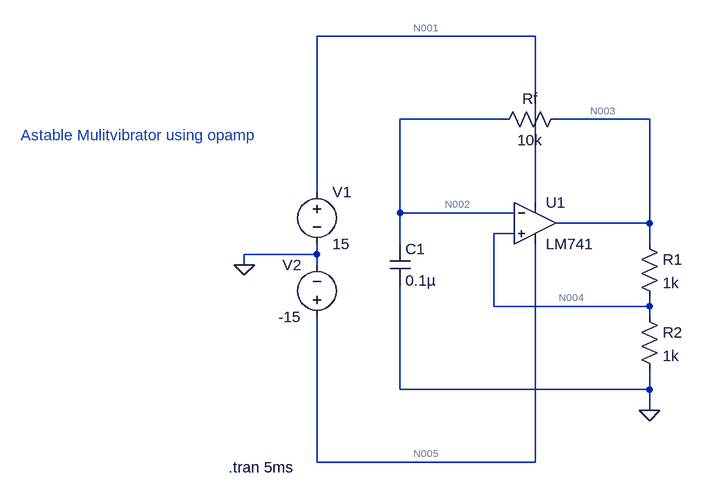
[diagram p0: schematic Astable_Multipvibrator.asc]
Astable_Multipvibrator.asc, the LTspice schematic file:
Version 4
SHEET 1 880 680
WIRE 448 -112 112 -112
WIRE 400 16 240 16
WIRE 624 16 480 16
WIRE 112 128 112 -112
WIRE 448 144 448 -112
WIRE 240 160 240 16
WIRE 416 160 240 160
WIRE 624 176 624 16
WIRE 624 176 480 176
WIRE 416 192 384 192
WIRE 240 208 240 160
WIRE 624 208 624 176
WIRE 112 224 112 208
WIRE 112 224 0 224
WIRE 0 240 0 224
WIRE 112 240 112 224
WIRE 384 304 384 192
WIRE 624 304 624 288
WIRE 624 304 384 304
WIRE 624 320 624 304
WIRE 240 432 240 272
WIRE 624 432 624 400
WIRE 624 432 240 432
WIRE 624 464 624 432
WIRE 112 544 112 320
WIRE 448 544 448 208
WIRE 448 544 112 544
FLAG 0 240 0
FLAG 624 464 0
SYMBOL voltage 112 112 R0
SYMATTR InstName V1
SYMATTR Value 15
SYMBOL OpAmps\\LM741 448 112 R0
SYMATTR InstName U1
SYMBOL voltage 112 336 R180
WINDOW 0 24 96 Left 2
WINDOW 3 24 16 Left 2
SYMATTR InstName V2
SYMATTR Value -15
SYMBOL res 608 192 R0
SYMATTR InstName R1
SYMATTR Value 1k
SYMBOL res 608 304 R0
SYMATTR InstName R2
SYMATTR Value 1k
SYMBOL res 496 0 R90
WINDOW 0 0 56 VBottom 2
WINDOW 3 32 56 VTop 2
SYMATTR InstName Rf
SYMATTR Value 10k
SYMBOL cap 224 208 R0
SYMATTR InstName C1
SYMATTR Value 0.1µ
TEXT -24 552 Left 2 !.tran 5ms
TEXT -344 40 Left 2 ;Astable Mulitvibrator using opamp

The netlist it stands for:
* Astable_Multipvibrator.asc
V1 N001 0 15
XU1 N004 N002 N001 N005 N003 LM741  ; pins In+ In- V+ V- OUT
V2 N005 0 -15
R1 N003 N004 1k
R2 N004 0 1k
Rf N003 N002 10k
C1 N002 0 0.1µ
.tran 5ms
* Astable Mulitvibrator using opamp
.lib LM741.lib
.backanno
.end

* Results of the author's LTspice run, read from the files saved beside the schematic
* Operating Point, zero values left out:
*   V(n001) = 15 V
*   V(n002) = 2.961 mV
*   V(n004) = 1.961 mV
*   V(n005) = -15 V
*   V(n003) = 3.979 mV
*   I(Rf) = 101.9 nA
*   I(R2) = 1.961 µA
*   I(R1) = 2.019 µA
*   I(V2) = 1.7 mA
*   I(V1) = -1.702 mA
*   Ix(u1:1) = 57.86 nA
*   Ix(u1:2) = 101.9 nA
*   Ix(u1:99) = 1.702 mA
*   Ix(u1:50) = -1.7 mA
*   Ix(u1:28) = -2.12 µA
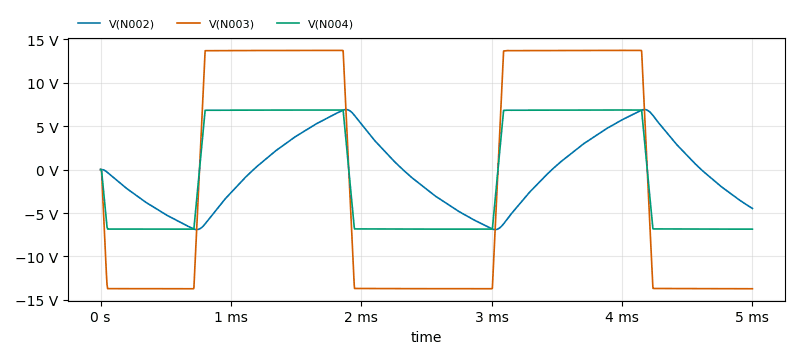
[diagram p1: Transient Analysis of Astable_Multipvibrator.asc, plotted from the saved traces]
* Transient Analysis, 1 run:
*   V(N002): min -6.91 V, max 6.912 V, average -184.6 mV, rms 4.221 V, last -4.475 V
*   V(N003): min -13.72 V, max 13.72 V, average -1.073 V, rms 13.34 V, last -13.71 V
*   V(N004): min -6.86 V, max 6.86 V, average -536.3 mV, rms 6.665 V, last -6.855 V